# Altium project finger_proc.PrjPcb
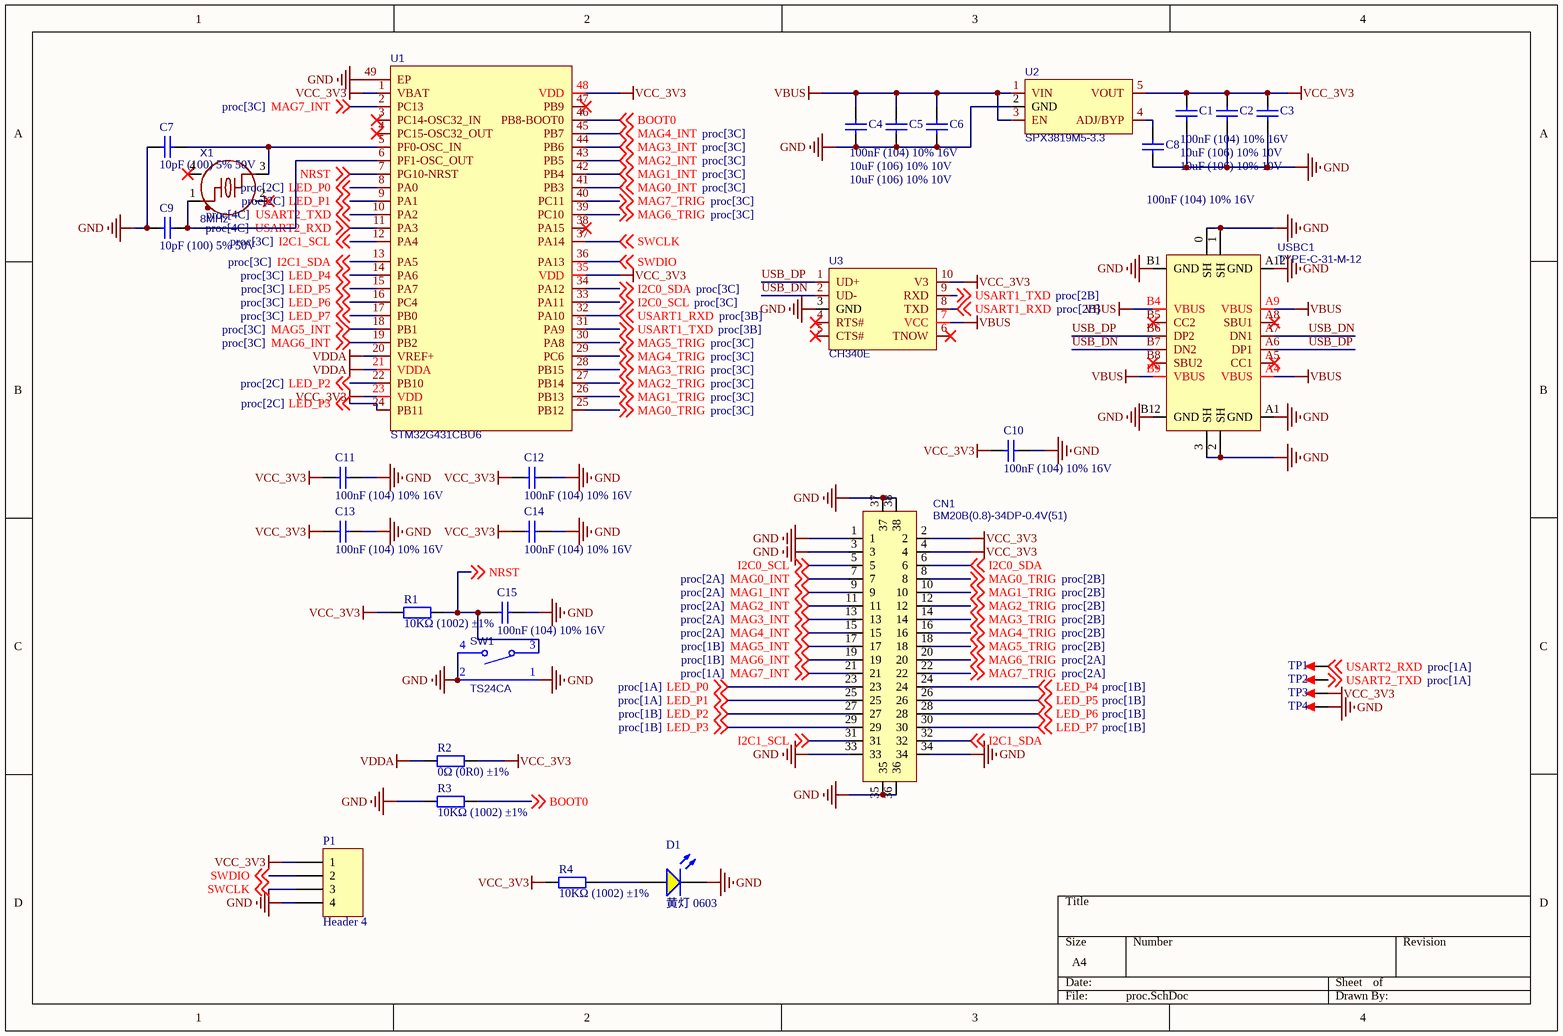
[diagram p0: proc.SchDoc]
1 sheet, 32 parts. Net scope: global (net labels, ports and power ports of the same name join across sheets).
Board file: proc.PcbDoc

## Sheet proc.SchDoc
size A4; SheetNumber: 1; SheetTotal: 1

### Parts
C1  100nF (104) 10% 16V  [LC-0402_C_NOSILK]
C2  10uF (106) 10% 10V  [LC-0603_C_NOSILK]
C3  10uF (106) 10% 10V  [LC-0603_C_NOSILK]
C4  100nF (104) 10% 16V  [LC-0402_C_NOSILK]
C5  10uF (106) 10% 10V  [LC-0603_C_NOSILK]
C6  10uF (106) 10% 10V  [LC-0603_C_NOSILK]
C7  10pF (100) 5% 50V  [LC-0402_C_NOSILK]
C8  100nF (104) 10% 16V  [LC-0402_C_NOSILK]
C9  10pF (100) 5% 50V  [LC-0402_C_NOSILK]
C10  100nF (104) 10% 16V  [LC-0402_C_NOSILK]
C11  100nF (104) 10% 16V  [LC-0402_C_NOSILK]
C12  100nF (104) 10% 16V  [LC-0402_C_NOSILK]
C13  100nF (104) 10% 16V  [LC-0402_C_NOSILK]
C14  100nF (104) 10% 16V  [LC-0402_C_NOSILK]
C15  100nF (104) 10% 16V  [LC-0402_C_NOSILK]
CN1  BM20B(0.8)-34DP-0.4V(51)  [CONN-SMD_34P-P0.40_BM20B-0.8-34DP-0.4V-51]
D1  黄灯 0603  [0603_LED_S1]
P1  Header 4  [HDR1X4]
R1  10KΩ (1002) ±1%  [LC-0402_R_NOSILK]
R2  0Ω (0R0) ±1%  [LC-0402_R_NOSILK]
R3  10KΩ (1002) ±1%  [LC-0402_R_NOSILK]
R4  10KΩ (1002) ±1%  [LC-0402_R_NOSILK]
SW1  TS24CA  [SW-SMD_TS24CA]
TP1  TEST  [TEST 1.6]  (value not drawn)
TP2  TEST  [TEST 1.6]  (value not drawn)
TP3  TEST  [TEST 1.6]  (value not drawn)
TP4  TEST  [TEST 1.6]  (value not drawn)
U1  STM32G431CBU6  [UFQFPN-48_L7.0-W7.0-P0.50-BL-EP]
U2  SPX3819M5-3.3  [SOT-23-5_L2.9-W1.6-P0.95-LS2.8-BL]
U3  CH340E  [MSOP-10_L3.0-W3.0-P0.50-LS5.0-BL]
USBC1  TYPE-C-31-M-12  [USB-C_SMD-TYPE-C-31-M-12]
X1  8MHz  [CRYSTAL-SMD_4P-L3.2-W2.5-BL]

### Nets
GND: C1.1 C2.1 C3.1 C4.1 C5.1 C6.1 C7.1 C8.1 C9.1 C10.2 C11.2 C12.2 C13.2 C14.2 C15.2 CN1.1 CN1.3 CN1.33 CN1.34 CN1.35 CN1.36 CN1.37 CN1.38 D1.K P1.4 R3.1 SW1.1 SW1.2 SW1.4 TP4.1 U1.49(EP) U2.2(GND) U3.3(GND) USBC1.0(SH) USBC1.1(SH) USBC1.2(SH) USBC1.3(SH) USBC1.A1(GND) USBC1.A12(GND) USBC1.B1(GND) USBC1.B12(GND)
VBUS: C4.2 C5.2 C6.2 U2.1(VIN) U2.3(EN) U3.7(VCC) USBC1.A4(VBUS) USBC1.A9(VBUS) USBC1.B4(VBUS) USBC1.B9(VBUS)
VCC_3V3: C1.2 C2.2 C3.2 C10.1 C11.1 C12.1 C13.1 C14.1 CN1.2 CN1.4 P1.1 R1.1 R2.2 R4.1 TP3.1 U1.1(VBAT) U1.23(VDD) U1.35(VDD) U1.48(VDD) U2.5(VOUT) U3.10(V3)
VDDA: R2.1 U1.20(VREF+) U1.21(VDDA)
BOOT0: R3.2 U1.46(PB8-BOOT0) ; off-sheet BOOT0
I2C0_SCL: CN1.5 U1.33(PA11) ; off-sheet I2C0_SCL
I2C0_SDA: CN1.6 U1.34(PA12) ; off-sheet I2C0_SDA
I2C1_SCL: CN1.31 U1.12(PA4) ; off-sheet I2C1_SCL
I2C1_SDA: CN1.32 U1.13(PA5) ; off-sheet I2C1_SDA
LED_P0: CN1.23 U1.8(PA0) ; off-sheet LED_P0
LED_P1: CN1.25 U1.9(PA1) ; off-sheet LED_P1
LED_P2: CN1.27 U1.22(PB10) ; off-sheet LED_P2
LED_P3: CN1.29 U1.24(PB11) ; off-sheet LED_P3
LED_P4: CN1.24 U1.14(PA6) ; off-sheet LED_P4
LED_P5: CN1.26 U1.15(PA7) ; off-sheet LED_P5
LED_P6: CN1.28 U1.16(PC4) ; off-sheet LED_P6
LED_P7: CN1.30 U1.17(PB0) ; off-sheet LED_P7
MAG0_INT: CN1.7 U1.41(PB3) ; off-sheet MAG0_INT
MAG0_TRIG: CN1.8 U1.25(PB12) ; off-sheet MAG0_TRIG
MAG1_INT: CN1.9 U1.42(PB4) ; off-sheet MAG1_INT
MAG1_TRIG: CN1.10 U1.26(PB13) ; off-sheet MAG1_TRIG
MAG2_INT: CN1.11 U1.43(PB5) ; off-sheet MAG2_INT
MAG2_TRIG: CN1.12 U1.27(PB14) ; off-sheet MAG2_TRIG
MAG3_INT: CN1.13 U1.44(PB6) ; off-sheet MAG3_INT
MAG3_TRIG: CN1.14 U1.28(PB15) ; off-sheet MAG3_TRIG
MAG4_INT: CN1.15 U1.45(PB7) ; off-sheet MAG4_INT
MAG4_TRIG: CN1.16 U1.29(PC6) ; off-sheet MAG4_TRIG
MAG5_INT: CN1.17 U1.18(PB1) ; off-sheet MAG5_INT
MAG5_TRIG: CN1.18 U1.30(PA8) ; off-sheet MAG5_TRIG
MAG6_INT: CN1.19 U1.19(PB2) ; off-sheet MAG6_INT
MAG6_TRIG: CN1.20 U1.39(PC10) ; off-sheet MAG6_TRIG
MAG7_INT: CN1.21 U1.2(PC13) ; off-sheet MAG7_INT
MAG7_TRIG: CN1.22 U1.40(PC11) ; off-sheet MAG7_TRIG
NRST: C15.1 R1.2 SW1.3 U1.7(PG10-NRST) ; off-sheet NRST
SWCLK: P1.3 U1.37(PA14) ; off-sheet SWCLK
SWDIO: P1.2 U1.36(PA13) ; off-sheet SWDIO
USART1_RXD: U1.32(PA10) U3.8(TXD) ; off-sheet USART1_RXD
USART1_TXD: U1.31(PA9) U3.9(RXD) ; off-sheet USART1_TXD
USART2_RXD: TP1.1 U1.11(PA3) ; off-sheet USART2_RXD
USART2_TXD: TP2.1 U1.10(PA2) ; off-sheet USART2_TXD
USB_DN: U3.2(UD-) USBC1.A7(DN1) USBC1.B7(DN2)
USB_DP: U3.1(UD+) USBC1.A6(DP1) USBC1.B6(DP2)
NetC7_2: C7.2 U1.5(PF0-OSC_IN) X1.3
NetC8_2: C8.2 U2.4(ADJ/BYP)
NetC9_2: C9.2 U1.6(PF1-OSC_OUT) X1.1
NetD1_A: D1.A R4.2

Not connected (* = marked no-connect by the designer): U1 3(PC14-OSC32_IN)* 4(PC15-OSC32_OUT)* 38(PA15)* 47(PB9)*; U3 4(RTS#)* 5(CTS#)* 6(TNOW)*; USBC1 A5(CC1)* A8(SBU1)* B5(CC2)* B8(SBU2)*; X1 2(GND)* 4(GND)*

### Library data of the parts
C1 C4 C8 C10-C15 = 0402 100nF (104) 10% 16V: 贴片电容; ComponentLink1Description: 供应商链接; ComponentLink1URL: http://www.szlcsc.com/product/details_1877.html; Package: 0402; Supplier: LC; SuppliersPartNumber: C1525
C2 C3 C5 C6 = 0603 10uF (106) 10% 10V: 贴片电容; ComponentLink1Description: 供应商链接; ComponentLink1URL: http://www.szlcsc.com/product/details_20411.html; Package: 0603; Supplier: LC; SuppliersPartNumber: C19702
C7 C9 = 0402 10pF (100) 5% 50V: 贴片电容; ComponentLink1Description: 供应商链接; ComponentLink1URL: http://www.szlcsc.com/product/details_33914.html; Package: 0402; Supplier: LC; SuppliersPartNumber: C32949
CN1 = BM20B(0.8)-34DP-0.4V(51): 0.4mm BTB连接器-34P 公; BOM_Manufacturer: HRS(广濑); Contributor: LCSC; BOM_Supplier: LCSC; BOM_Supplier Part: C424540; BOM_Manufacturer Part: BM20B(0.8)-34DP-0.4V(51); BOM_JLCPCB Part Class: Extended Part; spicePre: C; spiceSymbolName: BM20B(0.8)-34DP-0.4V(51)
D1 = 0603 黄灯: 发光二极管; ComponentLink1Description: 供应商链接; ComponentLink1URL: http://www.szlcsc.com/product/details_73147.html; Package: 0603; Supplier: LC; SuppliersPartNumber: C72038
P1 = Header 4: Header, 4-Pin; LatestRevisionDate: 17-Jul-2002; LatestRevisionNote: Re-released for DXP Platform.; Publisher: Altium Limited
R1 R3 R4 = 0402 10KΩ (1002) 1%: 贴片电阻; ComponentLink1Description: 供应商链接; ComponentLink1URL: http://www.szlcsc.com/product/details_26487.html; Package: 0402; Supplier: LC; SuppliersPartNumber: C25744
R2 = 0402 0Ω (0R0) 1%: 贴片电阻; ComponentLink1Description: 供应商链接; ComponentLink1URL: http://www.szlcsc.com/product/details_17853.html; Package: 0402; Supplier: LC; SuppliersPartNumber: C17168
SW1 = TS24CA: 按键; BOM_Manufacturer: SHOU HAN(首韩); Contributor: LCSC; BOM_Supplier: LCSC; BOM_Supplier Part: C393942; BOM_Manufacturer Part: TS24CA; BOM_JLCPCB Part Class: Extended Part; spicePre: S; spiceSymbolName: TS24CA
TP1-TP4 = TEST: 测试点; 版权归属: 源创客; BOM名称: 测试点; 学习资源: www.ooocke.com
U1 = STM32G431CBU6: BOM_Manufacturer: ST(意法半导体); Contributor: LCSC; BOM_Supplier: LCSC; BOM_Supplier Part: C529356; BOM_Manufacturer Part: STM32G431CBU6; BOM_JLCPCB Part Class: Extended Part; spicePre: U; spiceSymbolName: STM32G431CBU6
U2 = SPX3819M5-3.3: Vin=16V Vout=3.3V 500mA LDO; BOM_Manufacturer: null; Contributor: lcsc; BOM_Supplier: LCSC; BOM_Supplier Part: C9900018941; BOM_Manufacturer Part: SPX3819M5-3.3; BOM_JLCPCB Part Class: Extended Part; spicePre: U; spiceSymbolName: SPX3819M5-3.3
U3 = CH340E: ttl-usb; BOM_Manufacturer: WCH(南京沁恒); BOM_Supplier: LCSC; BOM_Manufacturer Part: CH340E; BOM_Supplier Part: C99652; BOM_JLCPCB Part Class: Extended Part; spicePre: U; spiceSymbolName: CH340E
USBC1 = TYPE-C-31-M-12: 贴片type-c母座; BOM_Manufacturer: 韩国韩荣; Contributor: LCSC; BOM_Supplier: LCSC; BOM_Supplier Part: C165948; BOM_Manufacturer Part: TYPE-C-31-M-12; BOM_JLCPCB Part Class: Extended Part; spicePre: U; spiceSymbolName: TYPE-C-31-M-12
X1 = 8MHz: BOM_Manufacturer: JWT(晶威特); BOM_Manufacturer Part: CF4008M00012T8188031; Contributor: LCSC; nameAlias: Frequency; BOM_Supplier: LCSC; BOM_Supplier Part: C2933033; spicePre: X; spiceSymbolName: CF4008M00012T8188031